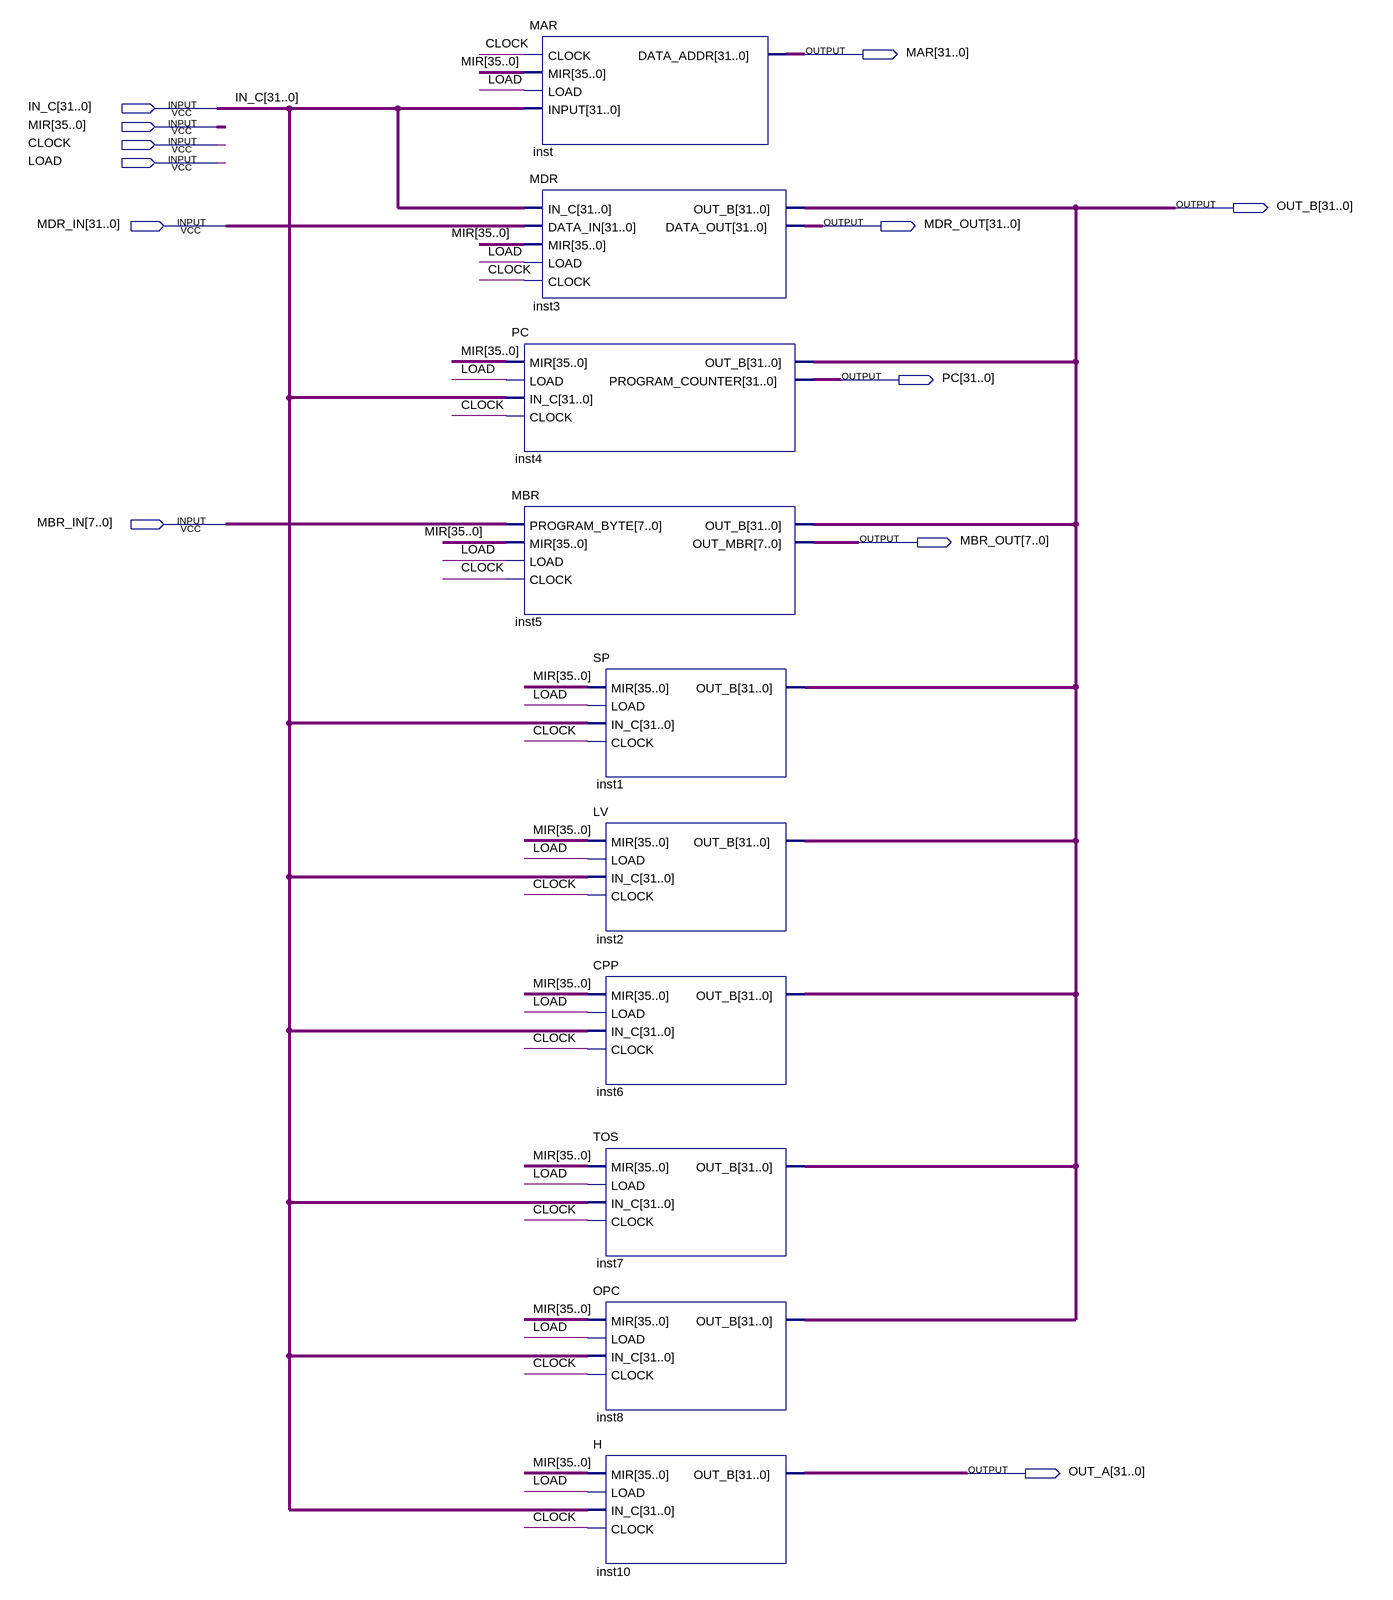
[diagram p0: schematic sheet]
// Quartus schematic BANK_REG.bdf as structural Verilog: 10 symbols, 12 pins
module BANK_REG (
  input  [31:0] IN_C,
  input  [35:0] MIR,
  input  CLOCK,
  input  LOAD,
  input  [31:0] MDR_IN,
  input  [7:0] MBR_IN,
  output [31:0] MAR,
  output [31:0] OUT_B,
  output [31:0] MDR_OUT,
  output [31:0] PC,
  output [7:0] MBR_OUT,
  output [31:0] OUT_A
);

  PC inst4 (.MIR(MIR), .LOAD(LOAD), .IN_C(IN_C), .CLOCK(CLOCK), .OUT_B(OUT_B), .PROGRAM_COUNTER(PC));
  MBR inst5 (.PROGRAM_BYTE(MBR_IN), .MIR(MIR), .LOAD(LOAD), .CLOCK(CLOCK), .OUT_B(OUT_B), .OUT_MBR(MBR_OUT));
  MAR inst (.CLOCK(CLOCK), .MIR(MIR), .LOAD(LOAD), .INPUT(IN_C), .DATA_ADDR(MAR));
  MDR inst3 (.IN_C(IN_C), .DATA_IN(MDR_IN), .MIR(MIR), .LOAD(LOAD), .CLOCK(CLOCK), .OUT_B(OUT_B), .DATA_OUT(MDR_OUT));
  SP inst1 (.MIR(MIR), .LOAD(LOAD), .IN_C(IN_C), .CLOCK(CLOCK), .OUT_B(OUT_B));
  LV inst2 (.MIR(MIR), .LOAD(LOAD), .IN_C(IN_C), .CLOCK(CLOCK), .OUT_B(OUT_B));
  CPP inst6 (.MIR(MIR), .LOAD(LOAD), .IN_C(IN_C), .CLOCK(CLOCK), .OUT_B(OUT_B));
  TOS inst7 (.MIR(MIR), .LOAD(LOAD), .IN_C(IN_C), .CLOCK(CLOCK), .OUT_B(OUT_B));
  OPC inst8 (.MIR(MIR), .LOAD(LOAD), .IN_C(IN_C), .CLOCK(CLOCK), .OUT_B(OUT_B));
  H inst10 (.MIR(MIR), .LOAD(LOAD), .IN_C(IN_C), .CLOCK(CLOCK), .OUT_B(OUT_A));
endmodule
